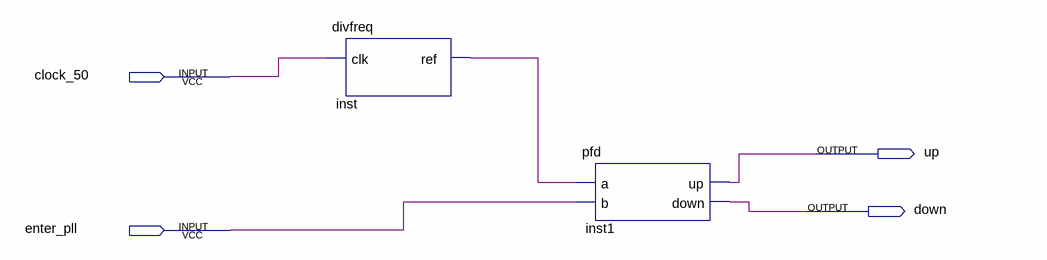
[diagram p0: schematic sheet]
// Quartus schematic trabalho-pll_V3.bdf as structural Verilog: 2 symbols, 4 pins
module \trabalho-pll_V3  (
  input  clock_50,
  input  enter_pll,
  output up,
  output down
);

  wire inst_ref;

  divfreq inst (.clk(clock_50), .\ref (inst_ref));
  pfd inst1 (.a(inst_ref), .b(enter_pll), .up(up), .down(down));
endmodule
